# Altium schematic sheet ANALOG_INPUT.SchDoc: Analog input
size A4; Author: eldar6776@hotmail.com; DrawnBy: Eldar Dedic; Organization: PROVEN d.o.o.; Address1: Adema Buće 102; Address2: 71000 Sarajevo; Address3: Federacija BiH; Address4: Bosna i Hercegovina; DocumentNumber: CD-26514; Revision: 001; SheetNumber: 1; SheetTotal: 8; ProjectName: KONTROLER TRANSPORTA MATERIJALA
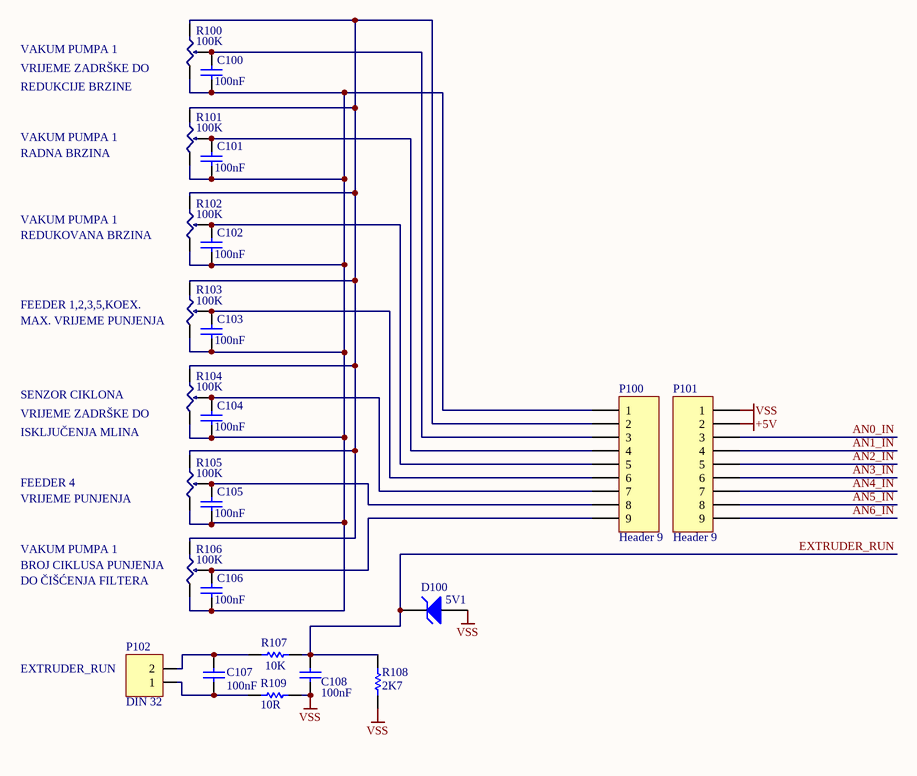
[diagram p0: ANALOG_INPUT.SchDoc]

## Parts
C100  value 100nF  [1206]
C101  value 100nF  [1206]
C102  value 100nF  [1206]
C103  value 100nF  [1206]
C104  value 100nF  [1206]
C105  value 100nF  [1206]
C106  value 100nF  [1206]
C107  value 100nF  [1206]
C108  value 100nF  [1206]
D100  5V1  [SOD80C]
P100  Header 9  [HDR1X9]
P101  Header 9  [HDR1X9]
P102  DIN 32  [TERMINAL BLOK 2]
R100  100K  [Poti]
R101  100K  [Poti]
R102  100K  [Poti]
R103  100K  [Poti]
R104  100K  [Poti]
R105  100K  [Poti]
R106  100K  [Poti]
R107  10K  [ERA-0805]
R108  2K7  [ERA-0805]
R109  10R  [ERA-0805]

## Nets
+5V: P101.2
VSS: C108.2 D100.1(A) P101.1 R108.2 R109.1
AN0_IN: P101.3
AN1_IN: P101.4
AN2_IN: P101.5
AN3_IN: P101.6
AN4_IN: P101.7
AN5_IN: P101.8
AN6_IN: P101.9
EXTRUDER_RUN: C108.1 D100.2(K) R107.1 R108.1
NetC100_1: C100.1 C101.1 C102.1 C103.1 C104.1 C105.1 C106.1 P100.1 R100.2 R101.2 R102.2 R103.2 R104.2 R105.2 R106.2
NetC100_2: C100.2 P100.3 R100.3
NetC101_2: C101.2 P100.4 R101.3
NetC102_2: C102.2 P100.5 R102.3
NetC103_2: C103.2 P100.6 R103.3
NetC104_2: C104.2 P100.7 R104.3
NetC105_2: C105.2 P100.8 R105.3
NetC106_2: C106.2 P100.9 R106.3
NetC107_1: C107.1 P102.2 R107.2
NetC107_2: C107.2 P102.1 R109.2
NetP100_2: P100.2 R100.1 R101.1 R102.1 R103.1 R104.1 R105.1 R106.1

## Notes on the sheet
- VAKUM PUMPA 1
- VRIJEME ZADRŠKE DO
- REDUKCIJE BRZINE
- RADNA BRZINA
- REDUKOVANA BRZINA
- FEEDER 1,2,3,5,KOEX.
- MAX. VRIJEME PUNJENJA
- SENZOR CIKLONA
- ISKLJUČENJA MLINA
- FEEDER 4
- VRIJEME PUNJENJA
- BROJ CIKLUSA PUNJENJA
- DO ČIŠĆENJA FILTERA
- EXTRUDER_RUN
- Title
- Size:
- Date:
- A4
- Number:
- Time:
- Revision:
- Sheet
- of
- File:

## Library data of the parts
C100-C108 = C1206: Ceramic Chip Capacitor - Standard; Published: 17-Jul-2002; LatestRevisionDate: 19-Mar-2004; LatestRevisionNote: Silkscreen size reduced.; DatasheetDocument: Mar-2001; PackageDocument: Mar-2001; PackageReference: 1206; Publisher: Altium Limited; Code_JEITA: 1206; Code_IPC: 3216 [1206]; ComponentLink1Description: Manufacturer Link; ComponentLink1URL: http://www.kemet.com/; ComponentLink2Description: Datasheet; ComponentLink2URL: http://www.kemet.com/kemet/web/homepage/kechome.nsf/vapubfilesname/F3102TA.pdf/$file/F3102TA.pdf
D100 = D Zener: Zener Diode; Published: 8-Jun-2000; LatestRevisionDate: 17-Jul-2002; LatestRevisionNote: Re-released for DXP Platform.; PackageReference: DIODE-0.7; Publisher: Altium Limited; PackageDescription: Diode, Thru-Hole; 2 Leads; 0.7 in Pin Spacing
P100 P101 = Header 9: Header, 9-Pin; LatestRevisionDate: 17-Jul-2002; LatestRevisionNote: Re-released for DXP Platform.; Publisher: Altium Limited
P102 = Terminal blok 2 pina: Terminal blok 2
R100-R106 = POTI
R107-R109 = ERA6Y: Rectangular Thick Film Chip Resistor, 10 Ohm to 1M Ohm Range, 0.1% and 0.5% Tolerance, 0805 Size, 0.1 W; Note: If flow soldering, adjust pad width of PCB Footprint to 0.7 - 0.8 times the width of the resistor.; Published: 17-Dec-2003; LatestRevisionDate: 19-Mar-2004; LatestRevisionNote: Silkscreen size reduced.; PackageDocument: Mar-2003; PackageReference: ERA-0805; Publisher: Altium Limited; Code_IPC: 2012 [0805]; ComponentLink1Description: Manufacturer Link; ComponentLink1URL: http://www.panasonic.com/industrial/components/resistive_products.htm; ComponentLink2Description: Datasheet; ComponentLink2URL: http://www.panasonic.com/industrial/components/pdf/AOA0000CE8.pdf